# Altium schematic sheet OBC_Connectors_Piggyback.SchDoc: Connectors / Piggyback
size A4; SheetNumber: 2; SheetTotal: 10
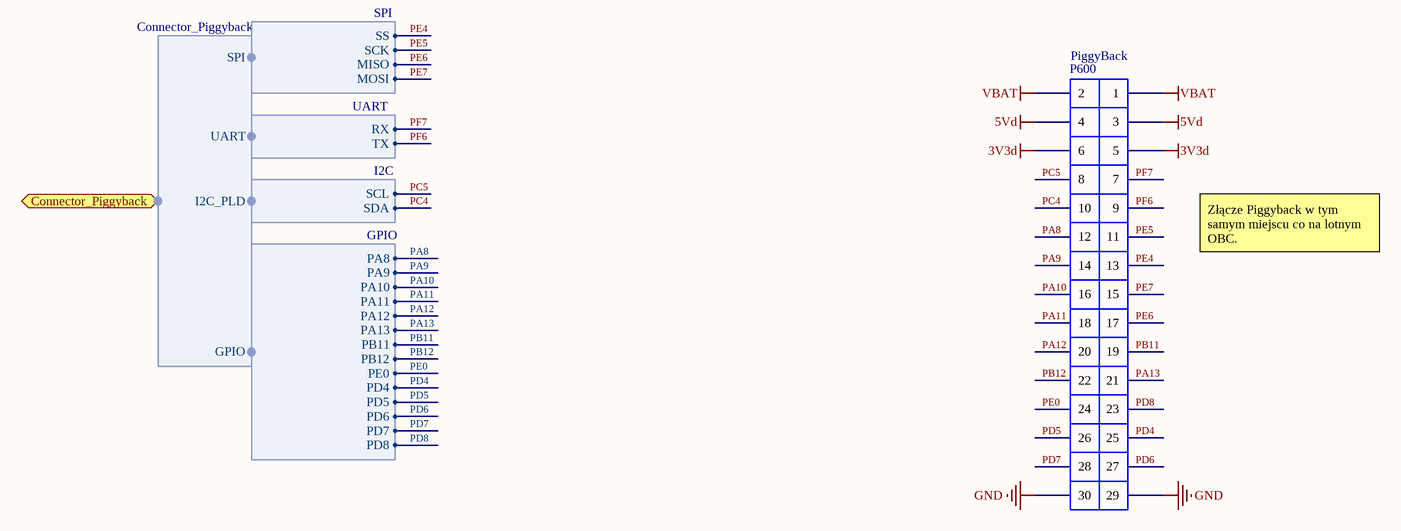
[diagram p0: OBC_Connectors_Piggyback.SchDoc]

## Parts
P600  PiggyBack  [Samtec_CES-115-01-L-D]

## Ports
Connector_Piggyback (harness Connector_Piggyback)

## Harnesses
Connector_Piggyback: UART, SPI, I2C_PLD, GPIO
I2C: SDA, SCL
UART: RX, TX
SPI: MISO, MOSI, SCK, SS
GPIO: PA8, PA9, PA10, PA11, PA12, PA13, PB11, PB12, PE0, PD4, PD5, PD6, PD7, PD8

## Nets
3V3d: P600.5 P600.6
5Vd: P600.3 P600.4
GND: P600.29 P600.30
VBAT: P600.1 P600.2
PA8: P600.12 ; harness GPIO.PA8
PA9: P600.14 ; harness GPIO.PA9
PA10: P600.16 ; harness GPIO.PA10
PA11: P600.18 ; harness GPIO.PA11
PA12: P600.20 ; harness GPIO.PA12
PA13: P600.21 ; harness GPIO.PA13
PB11: P600.19 ; harness GPIO.PB11
PB12: P600.22 ; harness GPIO.PB12
PC4: P600.10 ; harness I2C.SDA
PC5: P600.8 ; harness I2C.SCL
PD4: P600.25 ; harness GPIO.PD4
PD5: P600.26 ; harness GPIO.PD5
PD6: P600.27 ; harness GPIO.PD6
PD7: P600.28 ; harness GPIO.PD7
PD8: P600.23 ; harness GPIO.PD8
PE0: P600.24 ; harness GPIO.PE0
PE4: P600.13 ; harness SPI.SS
PE5: P600.11 ; harness SPI.SCK
PE6: P600.17 ; harness SPI.MISO
PE7: P600.15 ; harness SPI.MOSI
PF6: P600.9 ; harness UART.TX
PF7: P600.7 ; harness UART.RX

## Notes on the sheet
- Złącze Piggyback w tym samym miejscu co na lotnym OBC.
- Title:
- Project:
- Author:
- Model:
- Document Number:
- Checked by:
- Rev:
- Date:
- Approved by:
- Sheet:
- of
- File name:

## Library data of the parts
P600 = Samtec_CES-115-xx-x-D: Low Profile Socket Strips; partNo: CES-115-01-G-D; Manufacturer: Samtec; HelpUrl: http://suddendocs.samtec.com/catalog_english/slw.pdf; Value: PiggyBack; Supplier 1: Farnell; Farnell: 1806463